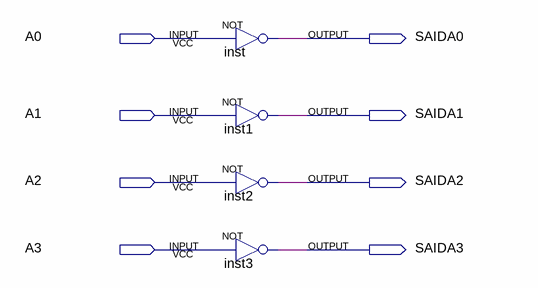
[diagram p0: schematic sheet]
// Quartus schematic nao.bdf as structural Verilog: 4 symbols, 8 pins
module nao (
  input  A0,
  input  A1,
  input  A2,
  input  A3,
  output SAIDA0,
  output SAIDA1,
  output SAIDA2,
  output SAIDA3
);

  not inst (SAIDA0, A0);
  not inst1 (SAIDA1, A1);
  not inst2 (SAIDA2, A2);
  not inst3 (SAIDA3, A3);
endmodule
